# EAGLE design inverter-supply-lv (EAGLE 9.6.2)
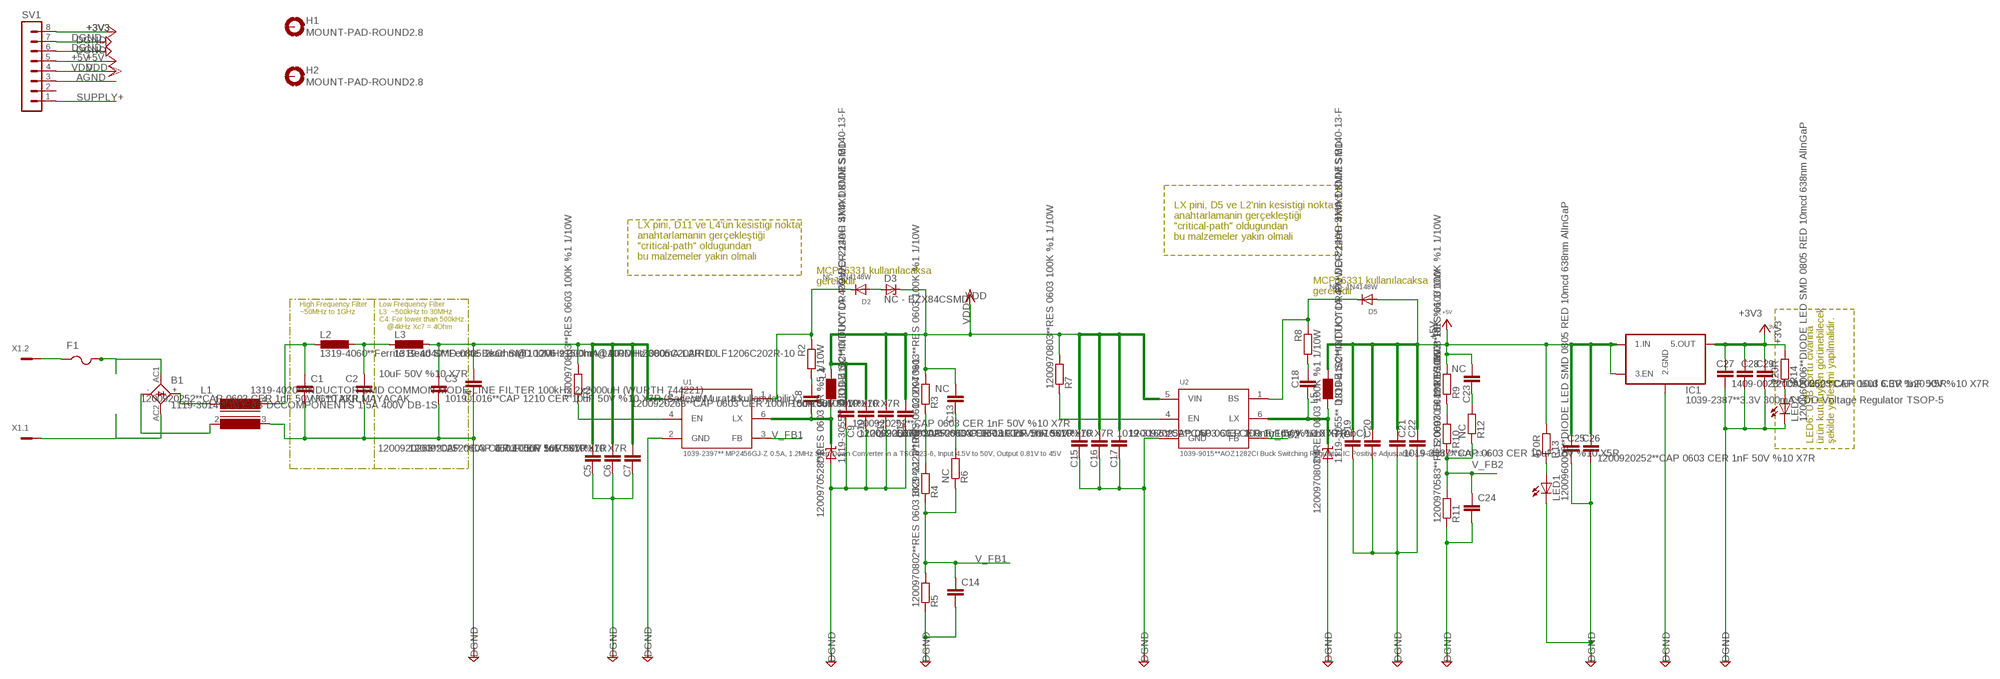
[diagram p0: schematic, sheet 1]

## Parts
B1  1119-3014**DB154S DCCOMPONENTS 1.5A 400V DB-1S  DF005S_DF10S  [DF005S_DF10S]
C1  NC**TAKILMAYACAK  C-EUC0603  [C0603]
C2  1200920252**CAP 0603 CER 1nF 50V %10 X7R  C-EUC0603E  [C0603_ENKO]
C3  1019-1016**CAP 1210 CER 10uF 50V %10 X7R (Sadece Murata kullanylabilir)  C-EUC1210  [C1210]
C4  10uF 50V %10 X7R  C-EUC0805E  [C0805_ENKO]
C5  4.7uF 50V %10 X7R  C-EUC0805E  [C0805_ENKO]
C6  1200920268**CAP 0603 CER 100nF 50V %10 X7R  C-EUC0603E  [C0603_ENKO]
C7  1200920252**CAP 0603 CER 1nF 50V %10 X7R  C-EUC0603E  [C0603_ENKO]
C8  1200920268**CAP 0603 CER 100nF 50V %10 X7R  C-EUC0603E  [C0603_ENKO]
C9  1200920252**CAP 0603 CER 1nF 50V %10 X7R  C-EUC0603E  [C0603_ENKO]
C10  1200920268**CAP 0603 CER 100nF 50V %10 X7R  C-EUC0603E  [C0603_ENKO]
C11  10uF 50V %10 X7R  C-EUC0805E  [C0805_ENKO]
C12  10uF 50V %10 X7R  C-EUC0805E  [C0805_ENKO]
C13  NC  C-EUC0603E  [C0603_ENKO]
C14  1200920271**CAP 0603 CER 10pF 50V%10 COG  C-EUC0603E  [C0603_ENKO]
C15  1200920567**CAP 0603 CER 1uF 25V %10X7R  C-EUC0603E  [C0603_ENKO]
C16  1200920268**CAP 0603 CER 100nF 50V %10 X7R  C-EUC0603E  [C0603_ENKO]
C17  1200920252**CAP 0603 CER 1nF 50V %10 X7R  C-EUC0603E  [C0603_ENKO]
C18  1200920268**CAP 0603 CER 100nF 50V %10 X7R  C-EUC0603E  [C0603_ENKO]
C19  1200920252**CAP 0603 CER 1nF 50V %10 X7R  C-EUC0603E  [C0603_ENKO]
C20  1019-3166**CAP 0603 CER 100nF 16V %10 X7R (AbC)  C-EUC0603E  [C0603_ENKO]
C21  1019-3387**CAP 0603 CER 10uF 10V %10 X5R  C-EUC0603E  [C0603_ENKO]
C22  1019-3387**CAP 0603 CER 10uF 10V %10 X5R  C-EUC0603E  [C0603_ENKO]
C23  NC  C-EUC0603E  [C0603_ENKO]
C24  1200920271**CAP 0603 CER 10pF 50V%10 COG  C-EUC0603E  [C0603_ENKO]
C25  1019-3166**CAP 0603 CER 100nF 16V %10 X7R (AbC)  C-EUC0603E  [C0603_ENKO]
C26  1200920252**CAP 0603 CER 1nF 50V %10 X7R  C-EUC0603E  [C0603_ENKO]
C27  1409-0023**CAP 0603 CER 10uf 6.3V %20 X5R  C-EUC0603E  [C0603_ENKO]
C28  1019-3166**CAP 0603 CER 100nF 16V %10 X7R (AbC)  C-EUC0603E  [C0603_ENKO]
C29  1200920252**CAP 0603 CER 1nF 50V %10 X7R  C-EUC0603E  [C0603_ENKO]
D1  1119-3055** DIODE SCHOTTKY 1A 40V DO-214AC SMA DIODES B140-13-F  SD-SMA  [SMA]
D2  NC - 1N4148W  DIODESOD-123  [SOD-123]
D3  NC - BZX84CSMD  BZX84CSMD  [TO236]
D4  1119-3055** DIODE SCHOTTKY 1A 40V DO-214AC SMA DIODES B140-13-F  SD-SMA  [SMA]
D5  NC - 1N4148W  DIODESOD-123  [SOD-123]
F1  PTCFUSE-1206  [R1206]
H1  MOUNT-PAD-ROUND2.8  [2,8-PAD]
H2  MOUNT-PAD-ROUND2.8  [2,8-PAD]
IC1  1039-2387**3.3V 300mA LDO Voltage Regulator TSOP-5  NCP115ASN330T2G  [NCP115ASN330T2G]
L1  1319-4020**INDUCTOR SMD COMMON MODE LINE FILTER 100kHz 2x2000uH (WURTH 744221)  ARYA_COMMON_FILTER  [ARYA_COMMON_FILTER]
L2  1319-4060**Ferrite Bead SMD 0805 2kOhm@100MHz 300mA LAIRD HZ0805C202R-10  L-EUL2012C  [L2012C]
L3  1319-4040**Ferrite Bead SMD 1206 915Ohm@100MHz 300mA LAIRD LF1206C202R-10  L-EUL3216C  [L3216C]
L4  1319-4102**INDUCTOR POWER 22UH 4X4X1.8MM SMD  WE-PD2_S  [WE-PD2_S]
L5  1319-4102**INDUCTOR POWER 22UH 4X4X1.8MM SMD  WE-PD2_S  [WE-PD2_S]
LED1  1200960006**DIODE LED SMD 0805 RED 10mcd 638nm AlInGaP  LEDCHIP-LED0805  [CHIP-LED0805]
LED2  1200960006**DIODE LED SMD 0805 RED 10mcd 638nm AlInGaP  LEDCHIP-LED0805  [CHIP-LED0805]
R1  1200970803**RES 0603 100K %1 1/10W  R-EU_R0603E  [R0603_ENKO]
R2  1200970528**RES 0603 0R %5 1/10W  R-EU_R0603E  [R0603_ENKO]
R3  1200970803**RES 0603 100K %1 1/10W  R-EU_R0603E  [R0603_ENKO]
R4  1029-2223**RES 0603 2K4 %1  R-EU_R0603E  [R0603_ENKO]
R5  1200970802**RES 0603 3K3 %1 1/10W  R-EU_R0603E  [R0603_ENKO]
R6  NC  R-EU_R0603E  [R0603_ENKO]
R7  1200970803**RES 0603 100K %1 1/10W  R-EU_R0603E  [R0603_ENKO]
R8  1200970803**RES 0603 100K %1 1/10W  R-EU_R0603E  [R0603_ENKO]
R9  1200970803**RES 0603 100K %1 1/10W  R-EU_R0603E  [R0603_ENKO]
R10  1200970584**RES 0603 18K %1 1/10W  R-EU_R0603E  [R0603_ENKO]
R11  1200970583**RES 0603 1K %1 1/10W  R-EU_R0603E  [R0603_ENKO]
R12  NC  R-EU_R0603E  [R0603_ENKO]
R13  470R  R-EU_R0603E  [R0603_ENKO]
R14  220R  R-EU_R0603E  [R0603_ENKO]
SV1  MA08-1  [MA08-1]
U1  1039-2397** MP2456GJ-Z 0.5A, 1.2MHz Step-Down Converter in a TSOT23-6, Input 4.5V to 50V, Output 0.81V to 45V  AOZ1282CI-1  [AOZ1282CI-1]
U2  1039-9015**AOZ1282CI Buck Switching Regulator IC Positive Adjustable 4.5-36V 1.2A SOT-23-6  AOZ1282CI-1  [AOZ1282CI-1]
X1  0289-9066**15EDGVC-3.81-02P-14  MCV2  [MCV2]

## Nets
+3V3: C27.1 C28.1 C29.1 IC1.5(5.OUT) R14.2 SV1.8
+5V: C19.2 C20.2 C21.1 C22.1 C23.2 C25.1 C26.1 D5.A IC1.1(1.IN) IC1.3(3.EN) L5.1 R9.2 R13.2 SV1.5
AGND: SV1.3
DGND: C1.1 C2.2 C3.1 C4.1 C5.1 C6.1 C7.1 C9.2 C10.1 C11.1 C12.1 C14.2 C15.1 C16.1 C17.1 C19.1 C20.1 C21.2 C22.2 C24.2 C25.2 C26.2 C27.2 C28.2 C29.2 D1.A D4.A IC1.2(2.GND) L1.3 LED1.C LED2.C R5.1 R11.1 SV1.6 SV1.7 U1.2(GND) U2.2(GND)
N$1: LED1.A R13.1
N$6: B1.AC1 F1.2
N$11: C8.2 D1.C L4.2 U1.6(LX)
N$18: B1.- L1.2
N$29: C18.1 R8.2
N$35: C8.1 R2.2
N$48: C2.1 L2.2 L3.1
N$55: F1.1 X1.2
N$59: C18.2 D4.C L5.2 U2.6(LX)
N$62: D5.C R8.1 U2.1(BS)
N$72: C3.2 C4.2 C5.2 C6.2 C7.2 L3.2 R1.2 U1.5(VIN)
N$98: B1.AC2 X1.1
N$99: C1.2 L1.4 L2.1
N$102: R7.1 U2.4(EN)
N$105: LED2.A R14.1
N$114: B1.+ L1.1
N$148: R1.1 U1.4(EN)
N$149: R3.1 R4.2
N$151: D2.C R2.1 U1.1(BS)
N$152: C13.1 R6.2
N$154: D2.A D3.A
N$155: R9.1 R10.2
N$159: C23.1 R12.2
SUPPLY+: SV1.1
V_FB1: C14.1 R4.1 R5.2 R6.1 U1.3(FB)
V_FB2: C24.1 R10.1 R11.2 R12.1 U2.3(FB)
VDD: C9.1 C10.2 C11.2 C12.2 C13.2 C15.2 C16.2 C17.2 D3.C L4.1 R3.2 R7.2 SV1.4 U2.5(VIN)
Unconnected: H1.B2,8(MOUNT) H2.B2,8(MOUNT) SV1.2

## Notes on the sheet
- LX pini, D5 ve L2'nin kesistigi nokta 
  anahtarlamanin gerçekleştiği 
  "critical-path" oldugundan
  bu malzemeler yakin olmali
- LX pini, D11 ve L4'ün kesistigi nokta 
  anahtarlamanin gerçekleştiği 
  "critical-path" oldugundan
  bu malzemeler yakin olmali
- MCP16331 kullanılacaksa 
  gereklidir
- MCP16331 kullanılacaksa 
  gereklidir
- High Frequency Filter
  ~50MHz to 1GHz
- Low Frequency Filter
  L3: ~500kHz to 30MHz 
  C4: For lower than 500kHz. 
      @4kHz Xc7 = 4Ohm
- LED6: USB portu civarina 
  ürün kutuluyken görünebilecek
  şekilde yerleşimi yapilmalidir.

## Library data of the parts
B1 = rectifier:DF005S_DF10S
C1 C3 = ercl:C-EU: CAPACITOR, European symbol
C2 C4-C29 = rcl:C-EU: CAPACITOR, European symbol
D1 D4 = diodes:SD-: Schottky diode
D2 D5 = adafruit:DIODE: Diode SMADIODE - SMA Surface Mount Package 20V 1A Schottky Diode Digikey: 641-1014-6-ND DO-1N4148 - Through Hole Small Current Diode SOD-123 20V 1 A (.5mV Vf) Schottky Diode - Digikey: MBRX120TPMSCT-ND SOD-323 10V 570mA (.38mV Vf, 3ns) Schottky Diode - Digikey: ZLLS410CT-ND SOD-523 30V 30mA Schottky Diode (RB751S-40TE61) - Digikey: RB751S-40TE61CT-ND SOT23-R/W - SOT23 Package (R = Solder Paste/Reflow Ovens, W = Hand-Soldering) BAT54Film 40V 300mA - Digikey: 497-7162-1-ND
D3 = diode:BZX84CSMD: Z DIODE
F1 = adafruit:PTCFUSE: PTC fuses, resettable thermistors
H1 H2 = holes:MOUNT-PAD-ROUND: MOUNTING PAD, round
IC1 = enko:NCP115ASN330T2G
L1 = enko:ARYA_COMMON_FILTER
L2 L3 = ercl:L-EU: INDUCTOR, European symbol
L4 L5 = wuerth-elektronik:WE-PD2: SMD-Power Inductors WE-PD2 Is recommended for the application with switching regulators from National Semiconductor, Linear Technology, Texas Instruments and Fairchild Semiconductor -- Switching regulators with low operating voltages (computer, laptop, mobile phones, pagers) -- Integrated DC/DC-converter
LED1 LED2 = led:LED: LED OSRAM: - CHIPLED LG R971, LG N971, LY N971, LG Q971, LY Q971, LO R971, LY R971 LH N974, LH R974 LS Q976, LO Q976, LY Q976 LO Q996 - Hyper CHIPLED LW Q18S LB Q993, LB Q99A, LB R99A - SideLED LS A670, LO A670, LY A670, LG A670, LP A670 LB A673, LV A673, LT A673, LW A673 LH A674 LY A675 LS A676, LA A676, LO A676, LY A676, LW A676 LS A679, LY A679, LG A679 - Hyper Micro SIDELED® LS Y876, LA Y876, LO Y876, LY Y876 LT Y87S - SmartLED LW L88C, LW L88S LB L89C, LB L89S, LG L890 LS L89K, LO L89K, LY L89K LS L896, LA L896, LO L896, LY L896 - TOPLED LS T670, LO T670, LY T670, LG T670, LP T670 LSG T670, LSP T670, LSY T670, LOP T670, LYG T670 LG T671, LOG T671, LSG T671 LB T673, LV T673, LT T673, LW T673 LH T674 LS T676, LA T676, LO T676, LY T676, LB T676, LH T676, LSB T676, LW T676 LB T67C, LV T67C, LT T67C, LS T67K, LO T67K, LY T67K, LW E67C LS E67B, LA E67B, LO E67B, LY E67B, LB E67C, LV E67C, LT E67C LW T67C LS T679, LY T679, LG T679 LS T770, LO T770, LY T770, LG T770, LP T770 LB T773, LV T773, LT T773, LW T773 LH T774 LS E675, LA E675, LY E675, LS T675 LS T776, LA T776, LO T776, LY T776, LB T776 LHGB T686 LT T68C, LB T68C - Hyper Mini TOPLED® LB M676 - Mini TOPLED Santana® LG M470 LS M47K, LO M47K, LY M47K Source: http://www.osram.convergy.de LUXEON: - LUMILED® LXK2-PW12-R00, LXK2-PW12-S00, LXK2-PW14-U00, LXK2-PW14-V00 LXK2-PM12-R00, LXK2-PM12-S00, LXK2-PM14-U00 LXK2-PE12-Q00, LXK2-PE12-R00, LXK2-PE12-S00, LXK2-PE14-T00, LXK2-PE14-U00 LXK2-PB12-K00, LXK2-PB12-L00, LXK2-PB12-M00, LXK2-PB14-N00, LXK2-PB14-P00, LXK2-PB14-Q00 LXK2-PR12-L00, LXK2-PR12-M00, LXK2-PR14-Q00, LXK2-PR14-R00 LXK2-PD12-Q00, LXK2-PD12-R00, LXK2-PD12-S00 LXK2-PH12-R00, LXK2-PH12-S00 LXK2-PL12-P00, LXK2-PL12-Q00, LXK2-PL12-R00 Source: www.luxeon.com KINGBRIGHT: KA-3528ASYC Source: www.kingbright.com
R1-R14 = rcl:R-EU_: RESISTOR, European symbol
SV1 = con-lstb:MA08-1: PIN HEADER; OC_FARNELL: unknown; OC_NEWARK: unknown
U1 U2 = enko:AOZ1282CI-1
X1 = con-phoenix-381_l:MCV2: Mini-Combicon 3.81mm vertikal 2polig (ohne Gegenstecker)

## Board
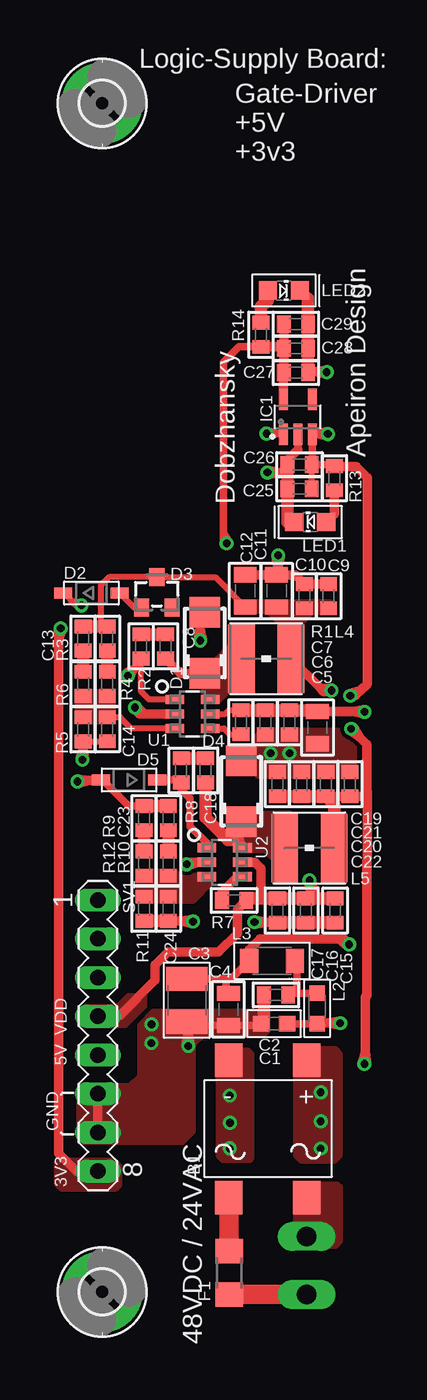
[diagram p1: board, top side]
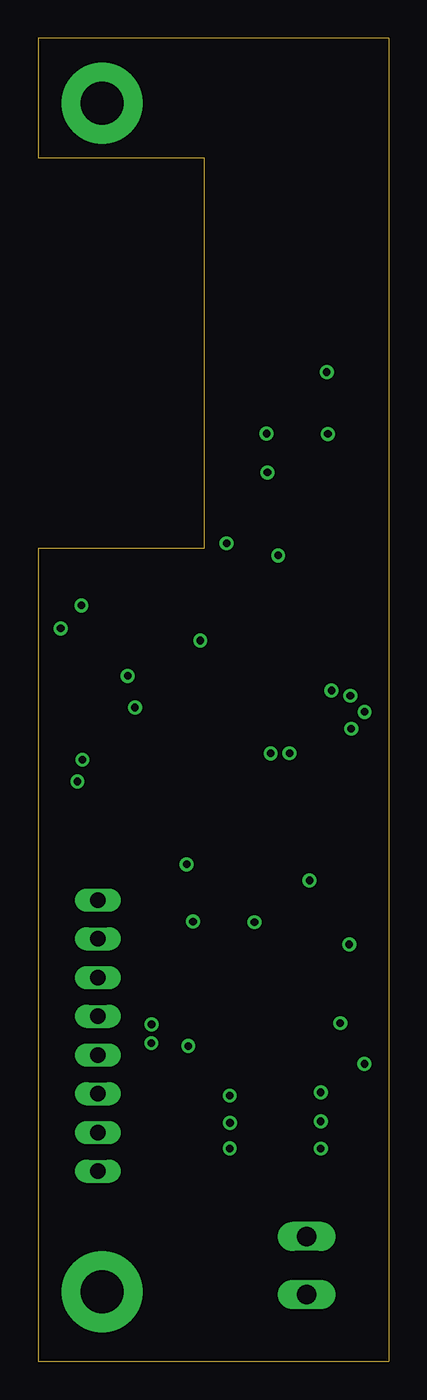
[diagram p2: board, inner layer Route3]
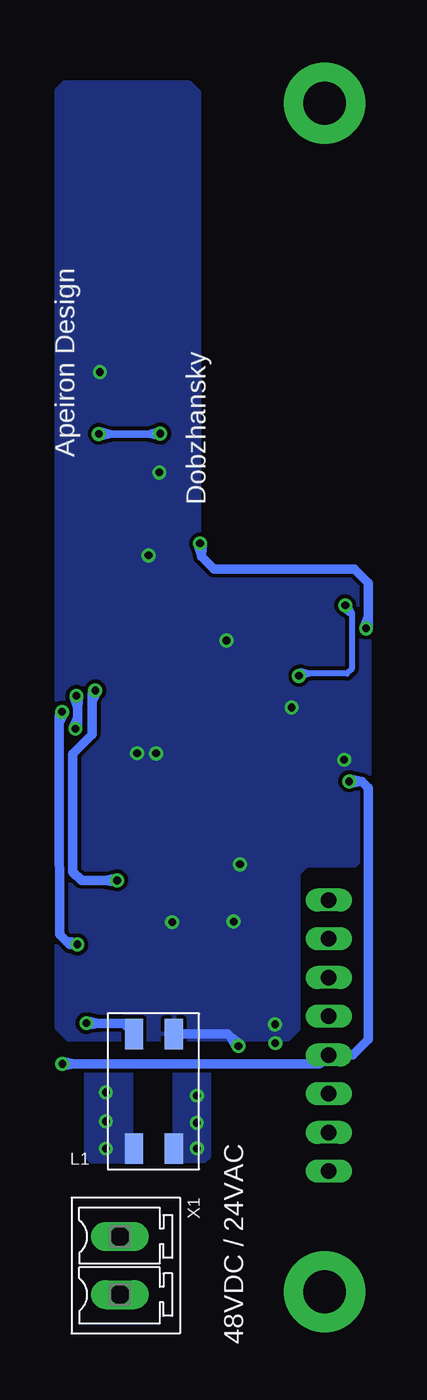
[diagram p3: board, bottom side, seen from below]

No outline drawn. Coordinates in mm, seen from the top.
Copper layers (1*3*16): Top 0.035mm / dielectric 1.5mm / Route3 0.035mm / dielectric 0.2mm / Bottom 0.035mm
Design rules "default *": minimum track width 10mil, minimum drill 0.5mm, track to track 10mil, track to pad 10mil, pad to pad 10mil, via to via 10mil, smd to smd 10mil, copper to edge 40mil, drill to drill 6mil, minimum pad ring 10mil, minimum via ring 8mil, stop-mask expansion 4mil, vias tented up to drill 0mil, thermal gap 10mil

### Footprints (pad centres in the part's own frame; a part is rotated, then mirrored left to right if it is on the bottom)
DF005S_DF10S = smd 1.8 x 2.2: + 5.1,9; - 0,9; AC1 0,0; AC2 5.1,0
C0603 = smd 1.1 x 1: 1 -0.85,0; 2 0.85,0
C0603_ENKO = smd 0.9 x 1.1: 1 -0.794,0; 2 0.794,0
C1210 = smd 1.6 x 2.7: 1 -1.4,0; 2 1.4,0
C0805_ENKO = smd 1 x 1.5: 1 -1.052,0; 2 1.052,0
SMA = smd 2 x 2: A 2,0; C -2,0
SOD-123 = smd 1.2 x 0.7: A 1.85,0; C -1.85,0
TO236 = smd 1 x 1.2: A -1,-1; C 0,1; NC 1,-1
R1206 = smd 1.6 x 1.803: 1 -1.422,0; 2 1.422,0
2,8-PAD = drill 2.8 pad 5.334: B2,8 0,0
NCP115ASN330T2G = smd 1.42 x 0.58: 1 -1.145,0.95; 2 -1.145,0; 3 -1.145,-0.95; 4 1.145,-0.95; 5 1.145,0.95
ARYA_COMMON_FILTER = smd 2 x 1.2: 1 -3.75,1.27; 2 -3.75,-1.34; 3 3.75,-1.34; 4 3.75,1.27
L2012C = smd 1 x 1: 1 -1,0; 2 1,0
L3216C = smd 1.2 x 1.6: 1 -1.5,0; 2 1.5,0
WE-PD2_S = smd 1.75 x 4.5: 1 -1.625,0; 2 1.625,0
CHIP-LED0805 = smd 1.2 x 1.2: A 0,-1.05; C 0,1.05
R0603_ENKO = smd 0.9 x 1.1: 1 -0.794,0; 2 0.794,0
MA08-1 = drill 1.016 long: 1 -8.89,0; 2 -6.35,0; 3 -3.81,0; 4 -1.27,0; 5 1.27,0; 6 3.81,0; 7 6.35,0; 8 8.89,0
AOZ1282CI-1 = smd 1.219 x 0.6: 1 -1.168,0.95; 2 -1.168,0; 3 -1.168,-0.95; 4 1.168,-0.95; 5 1.168,0; 6 1.168,0.95
MCV2 = drill 1.27 pad 1.905 long: 1 -1.905,0; 2 1.905,0

### Placement (x,y rotation side)
B1  12.52,10.74 0 top
C1  15.49,22.14 0 top
C2  15.61,24.03 180 top
C3  9.76,23.68 90 top
C4  12.49,23.08 90 top
C5  18.33,41.56 90 top
C6  16.5,41.9 90 top
C7  14.91,41.9 90 top
C8  8.37,46.88 270 top
C9  19.06,50.18 90 top
C10  17.48,50.18 270 top
C11  15.65,50.52 270 top
C12  13.59,50.52 270 top
C13  2.95,47.4 90 top
C14  4.54,41.45 270 top
C15  19.49,29.57 90 top
C16  17.58,29.57 90 top
C17  15.7,29.57 90 top
C18  10.98,38.75 270 top
C19  15.71,37.85 270 top
C20  17.3,37.85 270 top
C21  18.88,37.85 90 top
C22  20.46,37.85 90 top
C23  8.55,35.62 90 top
C24  8.55,29.68 270 top
C25  17.16,57.22 180 top
C26  17.16,58.8 180 top
C27  16.92,64.84 0 top
C28  16.92,66.43 0 top
C29  16.92,68.02 0 top
D1  10.94,47.11 90 top
D2  3.5,50.38 0 top
D3  7.79,50.43 0 top
D4  13.34,37.38 90 top
D5  5.97,38.13 180 top
F1  12.54,5.81 90 top
H1  4.2,4.56 0 top
H2  4.2,82.5 0 top
IC1  17.04,61.93 90 top
L1  15.43,17.71 90 bottom
L2  18.31,23.14 90 top
L3  15.35,26.26 180 top
L4  14.97,46.07 180 top
L5  17.81,33.66 180 top
LED1  17.86,55.04 90 top
LED2  16.13,70.22 270 top
R1  13.32,41.91 90 top
R2  6.76,46.88 90 top
R3  4.54,47.4 90 top
R4  4.54,44.42 90 top
R5  2.95,41.44 90 top
R6  2.95,44.42 90 top
R7  12.86,30.23 0 top
R8  9.39,38.75 90 top
R9  6.96,35.62 90 top
R10  6.96,32.65 90 top
R11  6.96,29.68 90 top
R12  8.55,32.65 90 top
R13  19.44,57.91 90 top
R14  14.63,67.32 270 top
SV1  3.92,21.36 270 top
U1  10.13,42.46 0 top
U2  12.24,32.73 0 top
X1  17.63,6.28 270 bottom

### Tracks (layer width: path | path; a pad name or v marks a point on that pad's centre or on a via)
+3V3  (via drill 0.5)
  Top 0.508: R14.2 13.18,66.53 12.17,65.52 12.17,54.36 | 12.17,54.36 12.17,54.05 12.37,53.85 v12.37,53.64 | 12.17,54.36 12.17,53.64 v12.37,53.64 | 12.17,54.36 12.54,53.74 v12.37,53.64
  Top 0.61: C29.1 C28.1 | C28.1 16.13,65.27 | 16.13,65.27 C27.1 | C28.1 16.03,66.53 R14.2 | IC1.5 16.09,65.23 16.13,65.27 | 1.34,47.32 1.34,13.65 2.52,12.47 SV1.8 | 1.34,47.32 1.34,47.92 v1.48,48.06 | 1.34,47.32 1.62,48 v1.48,48.06 | 1.34,47.32 1.33,48.06 v1.48,48.06
  Bottom 0.61: v1.48,48.06 1.32,48.22 1.32,48.79 | 1.32,48.79 1.32,51.03 2.26,51.97 11.46,51.97 12.28,52.79 12.28,52.9 | 12.22,53.64 v12.37,53.64 | v12.37,53.64 12.28,53.55 12.28,52.9 | 1.32,48.79 1.33,48.06 v1.48,48.06 | 1.32,48.79 1.62,48.12 v1.48,48.06 | 12.28,52.9 12.51,53.59 v12.37,53.64 | 12.28,52.9 12.22,53.63 v12.37,53.64
  pour Top (no thermals): 5.11,11.28 1.53,11.28 1.19,11.62 1.19,13.07 1.33,13.21 4.99,13.21 5.38,12.82 5.38,11.55
+5V  (via drill 0.5)
  Top 0.406: C25.1 C26.1
  Top 0.508: R9.2 5.94,36.41 4.22,38.13 D5.A | R13.2 19.34,58.8 C26.1 17.99,58.84 IC1.3 18.02,60.82 18.15,60.82 | v14.99,60.84 15.74,60.84 | 15.74,60.84 16.04,60.84 IC1.1 | 18.19,60.81 v19.02,60.81 | 18.15,60.82 18.19,60.81 | 18.19,60.81 18.85,60.63 18.96,60.6 v19.02,60.81 | 18.15,60.82 18.96,61.04 v19.02,60.81 | 15.74,60.84 15.04,61.03 v14.99,60.84 | 15.74,60.84 15.04,60.65 v14.99,60.84
  Top 0.61: 19.55,58.81 R13.2 19.48,58.66 20.88,58.66 21.6,57.95 21.6,44.42 21.16,43.98 | D5.A 4.08,38.09 3.33,38.09 | v2.58,38.03 2.64,38.09 3.33,38.09 | C21.1 C22.1 21.24,37.06 21.59,37.4 | 21.16,43.98 20.83,43.65 v20.49,43.65 | v20.55,41.48 21.08,40.95 | 21.08,40.95 21.59,40.44 21.59,37.4 | 21.59,37.4 21.6,37.39 21.58,28.44 | 21.58,28.44 | 21.58,28.44 21.57,23.98 21.48,23.89 21.48,19.58 v21.41,19.51 | 3.33,38.09 2.6,38.18 v2.58,38.03 | 3.33,38.09 2.62,37.89 v2.58,38.03 | 21.16,43.98 20.45,43.79 v20.49,43.65 | 21.16,43.98 20.58,43.53 v20.49,43.65 | 21.08,40.95 20.67,41.56 v20.55,41.48 | 21.08,40.95 20.47,41.36 v20.55,41.48 | v21.41,19.51 21.27,19.55 21.48,20.26 21.56,19.53 v21.41,19.51
  Top 0.813: R9.2 7.4,36.41 | 7.4,36.41 C23.2 | 7.42,36.43 7.4,36.41 | C19.2 C20.2 C21.1 19.43,36.5 L5.1
  Bottom 0.508: v19.02,60.81 18.19,60.81 | 18.15,60.82 15.74,60.82 | 15.74,60.82 15.21,60.82 15.19,60.8 15.03,60.8 v14.99,60.84 | 18.15,60.82 18.19,60.81 | 18.19,60.81 18.85,60.63 18.96,60.6 v19.02,60.81 | 18.15,60.82 18.96,61.04 v19.02,60.81 | 15.74,60.82 15.05,61.03 v14.99,60.84 | 15.74,60.82 15.04,60.65 v14.99,60.84
  Bottom 0.61: v2.58,38.03 1.83,38.03 | 1.83,38.03 1.75,38.03 1.32,37.6 1.32,21.12 2.35,20.09 SV1.5 4.53,19.51 20.66,19.51 | v20.49,43.65 20.41,43.57 20.41,42.9 | 20.41,42.9 20.41,42.22 | 20.41,42.22 20.41,41.62 v20.55,41.48 | v21.41,19.51 20.66,19.51 | 1.83,38.03 2.55,37.88 v2.58,38.03 | 1.83,38.03 2.55,38.17 v2.58,38.03 | 20.41,42.9 20.63,43.6 v20.49,43.65 | 20.41,42.9 20.34,43.64 v20.49,43.65 | 20.41,42.22 20.4,41.48 v20.55,41.48 | 20.41,42.22 20.69,41.54 v20.55,41.48 | 20.66,19.51 21.38,19.36 v21.41,19.51 | 20.66,19.51 21.38,19.66 v21.41,19.51
DGND  (via drill 0.5)
  Top 0.406: R5.1 4.53,40.65 C14.2
  Top 0.508: C3.1 10.01,22.03 C4.1 14.53,22.03 C1.1 14.67,22.17 14.81,22.31 | 17.04,59.79 IC1.2
  Top 0.61: v9.85,20.68 9.85,21.43 | 9.85,21.43 9.85,21.86 10.01,22.03 | 17.71,64.63 C27.2 17.77,64.9 18.19,64.9 | C12.1 C11.1 | C11.1 16.88,51.57 C10.1 C9.2 | C11.1 15.75,51.67 15.75,52.1 | 15.75,52.1 v15.75,52.85 | D1.A 10.64,48.81 10.64,48.02 | 10.64,48.02 v10.64,47.27 | R5.1 2.95,40.2 | 2.95,40.2 2.95,39.73 2.91,39.69 v2.91,39.45 | U1.2 6.98,42.46 | 6.98,42.46 6.67,42.46 6.36,42.77 v6.36,42.88 | C24.2 9.42,28.89 | 9.42,28.89 9.8,28.89 9.89,28.8 10.13,28.8 v10.17,28.84 | C17.1 14.95,28.77 | 14.95,28.77 14.23,28.77 v14.2,28.8 | v9.75,32.59 9.89,32.73 10.49,32.73 | U2.2 10.49,32.73 | 17.04,59.79 16.37,59.11 C26.2 | 16.37,58.15 16.25,58.27 15.8,58.27 | 15.8,58.27 15.07,58.27 v15.05,58.29 | 18.19,64.9 18.91,64.9 v18.94,64.87 | 20.55,38.73 C22.2 | SV1.7 SV1.6 | 9.85,21.43 9.71,20.71 v9.85,20.68 | 9.85,21.43 9.99,20.71 v9.85,20.68 | 15.75,52.1 15.89,52.82 v15.75,52.85 | 15.75,52.1 15.61,52.82 v15.75,52.85 | 10.64,48.02 10.49,47.3 v10.64,47.27 | 10.64,48.02 10.79,47.3 v10.64,47.27 | 2.95,40.2 2.77,39.49 v2.91,39.45 | 2.95,40.2 3.06,39.47 v2.91,39.45 | 6.98,42.46 6.47,42.98 v6.36,42.88 | 6.98,42.46 6.3,42.74 v6.36,42.88 | 9.42,28.89 10.13,28.7 v10.17,28.84 | 9.42,28.89 10.15,28.99 v10.17,28.84 | 14.95,28.77 14.23,28.94 v14.2,28.8 | 14.95,28.77 14.22,28.65 v14.2,28.8 | 10.49,32.73 9.75,32.74 v9.75,32.59 | 10.49,32.73 9.81,32.45 v9.75,32.59 | 15.8,58.27 15.08,58.44 v15.05,58.29 | 15.8,58.27 15.07,58.14 v15.05,58.29 | 18.19,64.9 18.91,64.73 v18.94,64.87 | 18.19,64.9 18.92,65.02 v18.94,64.87
  Top 0.813: C15.1 C16.1 C17.1 | C24.2 R11.1 | LED2.C 17.71,69.69 C29.2 C28.2 C27.2 | LED1.C 16.37,55.04 C25.2 16.37,58.15 C26.2 | C2.2 14.81,24.02 14.81,22.31 | 14.67,22.17 14.53,22.03
  Bottom 0.61: L1.3 10.57,21.46 10.35,21.24 | v9.85,20.68 9.85,20.74 10.35,21.24 | 10.35,21.24 9.76,20.8 v9.85,20.68 | 10.35,21.24 9.98,20.61 v9.85,20.68
  other vias: 15.26,39.87 16.5,39.88 7.45,22.1 7.43,20.87
  pour Bottom: 6.62,21.11 21.02,21.11 21.79,21.88 21.79,83.35 21.28,83.86 13.07,83.86 12.43,83.22 12.43,53.05 11.19,51.81 1.91,51.81 1.27,51.17 1.27,33.46 2.2,32.53 5.39,32.53 5.92,32 5.92,21.81
  pour Top (no thermals): 14.66,41.39 19.76,41.39 20.79,40.36 20.79,38.62 20.52,38.35 14.41,38.35 14.13,38.63 14.13,40.86
  pour Top (no thermals): 7.56,22.99 14.56,22.99 15.07,22.48 15.07,21.65 14.79,21.37 10.84,21.37 10.21,20.74 10.21,15.05 9.49,14.33 3,14.33 2.65,14.68 2.65,17.83 2.91,18.09 6.01,18.09 6.65,18.73 6.65,22.08
N$1
  Top 0.61: R13.1 19.44,55.57 LED1.A
N$2
  Route3 0: 23,86.77 0,86.77
N$3
  Route3 0: 23,86.77 23,0
N$4
  Route3 0.001: 0,86.77 0,78.94
N$5
  Route3 0.001: 0,78.94 10.9,78.94
N$6
  Top 1.27: F1.2 12.54,10.72 B1.AC1
N$7
  Route3 0.001: 10.9,78.94 10.9,53.29
N$8
  Route3 0.001: 10.9,53.29 0,53.29
N$9
  Route3 0.001: 0,53.29 0,0
N$10
  Route3 0: 0,0 23,0
N$11
  Top 0.61: C8.2 9.35,45.11 D1.C
  pour Top (no thermals): 10.84,43.26 11.84,43.26 14.07,45.49 14.07,46.49 13.64,46.92 12.55,46.92 10.84,45.21
N$18  (via drill 0.5)
  other vias: 12.58,17.43 12.59,15.64 12.58,13.96
  pour Top (no thermals): 13.89,13.15 12.09,13.15 11.79,13.45 11.79,19.92 12.29,20.42 13.82,20.42 14.03,20.21 14.03,13.29
  pour Bottom (no thermals): 13.88,13.14 12.1,13.14 11.79,13.45 11.79,20 12.21,20.42 13.83,20.42 14.03,20.22 14.03,13.29
N$29
  Top 0.813: R8.2 C18.1
N$35
  Top 0.813: R2.2 C8.1
N$48
  Top 0.508: C2.1 16.51,24.14 16.99,24.14 | 16.99,24.14 L2.2 | L3.1 16.99,26.12 16.99,24.14
N$55
  Top 1.27: F1.1 17.62,4.39 X1.2
N$59
  Top 0.508: 13.12,34.19 13.41,33.9 U2.6
  Top 0.813: C18.2 10.98,35.67 12.46,34.19 13.12,34.19
  pour Top (no thermals): 13.32,33.46 14.9,33.46 15.57,32.79 16.62,32.79 16.91,33.08 16.91,35.57 16.52,35.96 13.16,35.96 12.91,35.71 12.91,33.87
N$62
  Top 0.508: U2.1 11.07,33.98 9.98,35.07 9.98,36.92 9.39,37.51 R8.1 9.39,38.06 9.32,38.13 D5.C
N$72  (via drill 0.5)
  Top 0.406: U1.5 12.27,42.46 12.51,42.7 R1.2
  Top 0.508: L3.2 12.67,25.08 12.33,25.08 | 12.33,25.08 C3.2 | C4.2 12.33,24.29 12.33,25.08
  Top 0.61: C5.2 20.68,42.61 | 20.68,42.61 21.41,42.61 v21.43,42.59 | v20.42,27.34 20.07,27.69 19.76,27.69 | 19.76,27.69 14.57,27.69 13.85,26.97 L3.2 | 20.68,42.61 21.4,42.45 v21.43,42.59 | 20.68,42.61 21.41,42.74 v21.43,42.59 | 19.76,27.69 20.33,27.23 v20.42,27.34 | 19.76,27.69 20.46,27.48 v20.42,27.34
  Top 0.813: C5.2 18.26,42.68 C6.2 C7.2 13.36,42.69 R1.2
  Bottom 0.61: v21.43,42.59 21.43,42.53 21.6,42.36 21.6,41.86 | 21.6,41.86 21.6,36.9 21.58,27.99 21.14,27.55 | v20.42,27.34 20.93,27.34 21.14,27.55 | 21.6,41.86 21.58,42.59 v21.43,42.59 | 21.6,41.86 21.3,42.53 v21.43,42.59 | 21.14,27.55 20.41,27.49 v20.42,27.34 | 21.14,27.55 20.49,27.21 v20.42,27.34
N$98
  pour Top (no thermals): 17.35,11.64 19.65,11.64 19.86,11.43 19.86,7.86 19.56,7.56 17.12,7.56 16.88,7.8 16.88,11.17
N$99  (via drill 0.5)
  Top 0.508: C1.2 L2.1
  Top 0.61: v19.83,22.18 19.08,22.18 | 19.08,22.18 18.35,22.18 L2.1 | 19.08,22.18 19.8,22.04 v19.83,22.18 | 19.08,22.18 19.8,22.32 v19.83,22.18
  Bottom 0.61: L1.4 17.4,22.16 19.08,22.16 | v19.83,22.18 19.81,22.16 19.08,22.16 | 19.08,22.16 19.8,22.03 v19.83,22.18 | 19.08,22.16 19.8,22.32 v19.83,22.18
N$102
  Top 0.61: R7.1 12.07,30.8 13.05,31.78 U2.4
N$105
  Top 0.813: LED2.A 15.08,69.6 14.63,69.15 R14.1
N$114  (via drill 0.5)
  other vias: 18.55,17.64 18.55,15.74 18.55,13.95
  pour Top (no thermals): 17.4,20.51 19.53,20.51 19.84,20.2 19.84,13.48 19.47,13.11 17.24,13.11 16.88,13.47 16.88,19.99
  pour Bottom (no thermals): 18.96,20.51 19.53,20.51 19.84,20.2 19.84,13.48 19.47,13.11 17.24,13.11 16.88,13.47 16.88,20.05 17.1,20.27 17.34,20.51
N$148
  Top 0.406: U1.4 12.19,41.51 12.58,41.12 R1.1
N$149
  Top 0.813: R4.2 R3.1
N$151  (via drill 0.5)
  Top 0.406: U1.1 7.27,43.41 6.75,43.93 6.75,45.85 | R2.1 6.75,46.08 6.75,45.85 | D2.C 2.15,49.88 | 2.15,49.88 2.4,49.63 2.78,49.63 v2.84,49.57 | v5.88,44.95 6.45,45.52 | 6.48,45.58 6.75,45.85 | 2.15,49.88 2.67,49.39 v2.84,49.57 | 2.15,49.88 2.86,49.82 v2.84,49.57 | 6.48,45.58 5.75,45.23 v5.88,44.95 | 6.48,45.58 6.45,45.52 | 6.45,45.52 6.18,44.94 | v5.88,44.95 6.12,44.83
  Bottom 0.406: v2.84,49.57 2.42,49.15 2.42,48.95 | 2.42,48.95 2.42,45.4 2.73,45.09 5.2,45.09 | 5.2,45.09 5.88,45.09 v5.88,44.95 | 2.42,48.95 2.99,49.37 v2.84,49.57 | 2.42,48.95 2.6,49.63 v2.84,49.57 | 5.2,45.09 5.83,44.83 v5.88,44.95 | 5.2,45.09 5.79,45.26 v5.88,44.95
N$152
  Top 0.813: R6.2 C13.1
N$154
  Top 0.406: D2.A 6.3,49.43 D3.A
N$155
  Top 0.813: R10.2 R9.1
N$159
  Top 0.813: R12.2 C23.1
V_FB1
  Top 0.406: U1.3 6.11,41.51 5.39,42.23 C14.1
  Top 0.61: C14.1 | R4.1 4.63,43.72
  pour Top (no thermals): 2.67,43.92 4.9,43.92 4.94,43.88 4.94,42.09 4.79,41.94 2.7,41.94 2.55,42.09 2.55,43.8
V_FB2
  Top 0.61: R12.1
  pour Top (no thermals): 6.75,32.16 9.03,32.16 9.28,31.91 11.29,31.91 11.41,31.79 11.41,31.39 10.19,30.17 6.85,30.17 6.56,30.46 6.56,31.97
VDD  (via drill 0.5)
  Top 0.406: R3.2 4.11,48.62 4.11,50.88 4.66,51.43 D3.C 11.63,51.43 C12.2
  Top 0.61: U2.5 13.43,32.71 14.23,32.71 14.61,32.34 14.61,30.36 | L4.1 18.52,44.15 | 18.52,44.15 18.73,43.94 19.2,43.94 v19.25,43.99 | R7.2 13.07,29.65 13.07,28.08 11.84,26.84 8.54,26.84 7.68,25.98 7.68,25 5.38,22.7 4.02,22.7 SV1.4 | C15.2 18.5,30.36 18.04,30.82 | 18.04,30.82 17.81,31.05 v17.81,31.54 | 18.52,44.15 19.19,43.85 v19.25,43.99 | 18.52,44.15 19.25,44.14 v19.25,43.99 | 18.04,30.82 17.96,31.56 v17.81,31.54 | 18.04,30.82 17.68,31.47 v17.81,31.54
  Top 0.813: C15.2 C16.2 C17.2 14.61,30.36 13.78,30.36 R7.2 | C13.2 R3.2
  Bottom 0.61: v19.25,43.99 19.46,43.78 19.46,43.27 | 19.46,43.27 19.46,41.12 20.74,39.84 20.74,36.9 20.73,32.11 20.16,31.54 18.56,31.54 | v17.81,31.54 18.56,31.54 | 19.46,43.27 19.4,44 v19.25,43.99 | 19.46,43.27 19.12,43.92 v19.25,43.99 | 18.56,31.54 17.84,31.69 v17.81,31.54 | 18.56,31.54 17.84,31.39 v17.81,31.54
  pour Top (no thermals): 19.18,49.09 18.01,49.09 17.32,48.4 17.32,46.8 17.07,46.55 16.06,46.55 15.86,46.75 15.86,48.37 15.07,49.16 13.15,49.16 12.99,49.32 12.99,49.83 19.18,49.83 19.46,49.55 19.46,49.37
  pour Top (no thermals): 3.11,23.27 5.18,23.27 5.92,24.01 7.01,24.01 7.01,23.31 5.7,22 3.05,22 2.66,22.39 2.66,22.82

### Text on the board
tPlace: Logic-Supply Board: | Gate-Driver / +5V / +3v3 | Apeiron Design | Dobzhansky | VDD | 5V | GND | 3V3 | 48VDC / 24VAC
bPlace: Apeiron Design | Dobzhansky | 48VDC / 24VAC